# EAGLE design EndSwitch_OptoBoard (EAGLE 9.2.1)
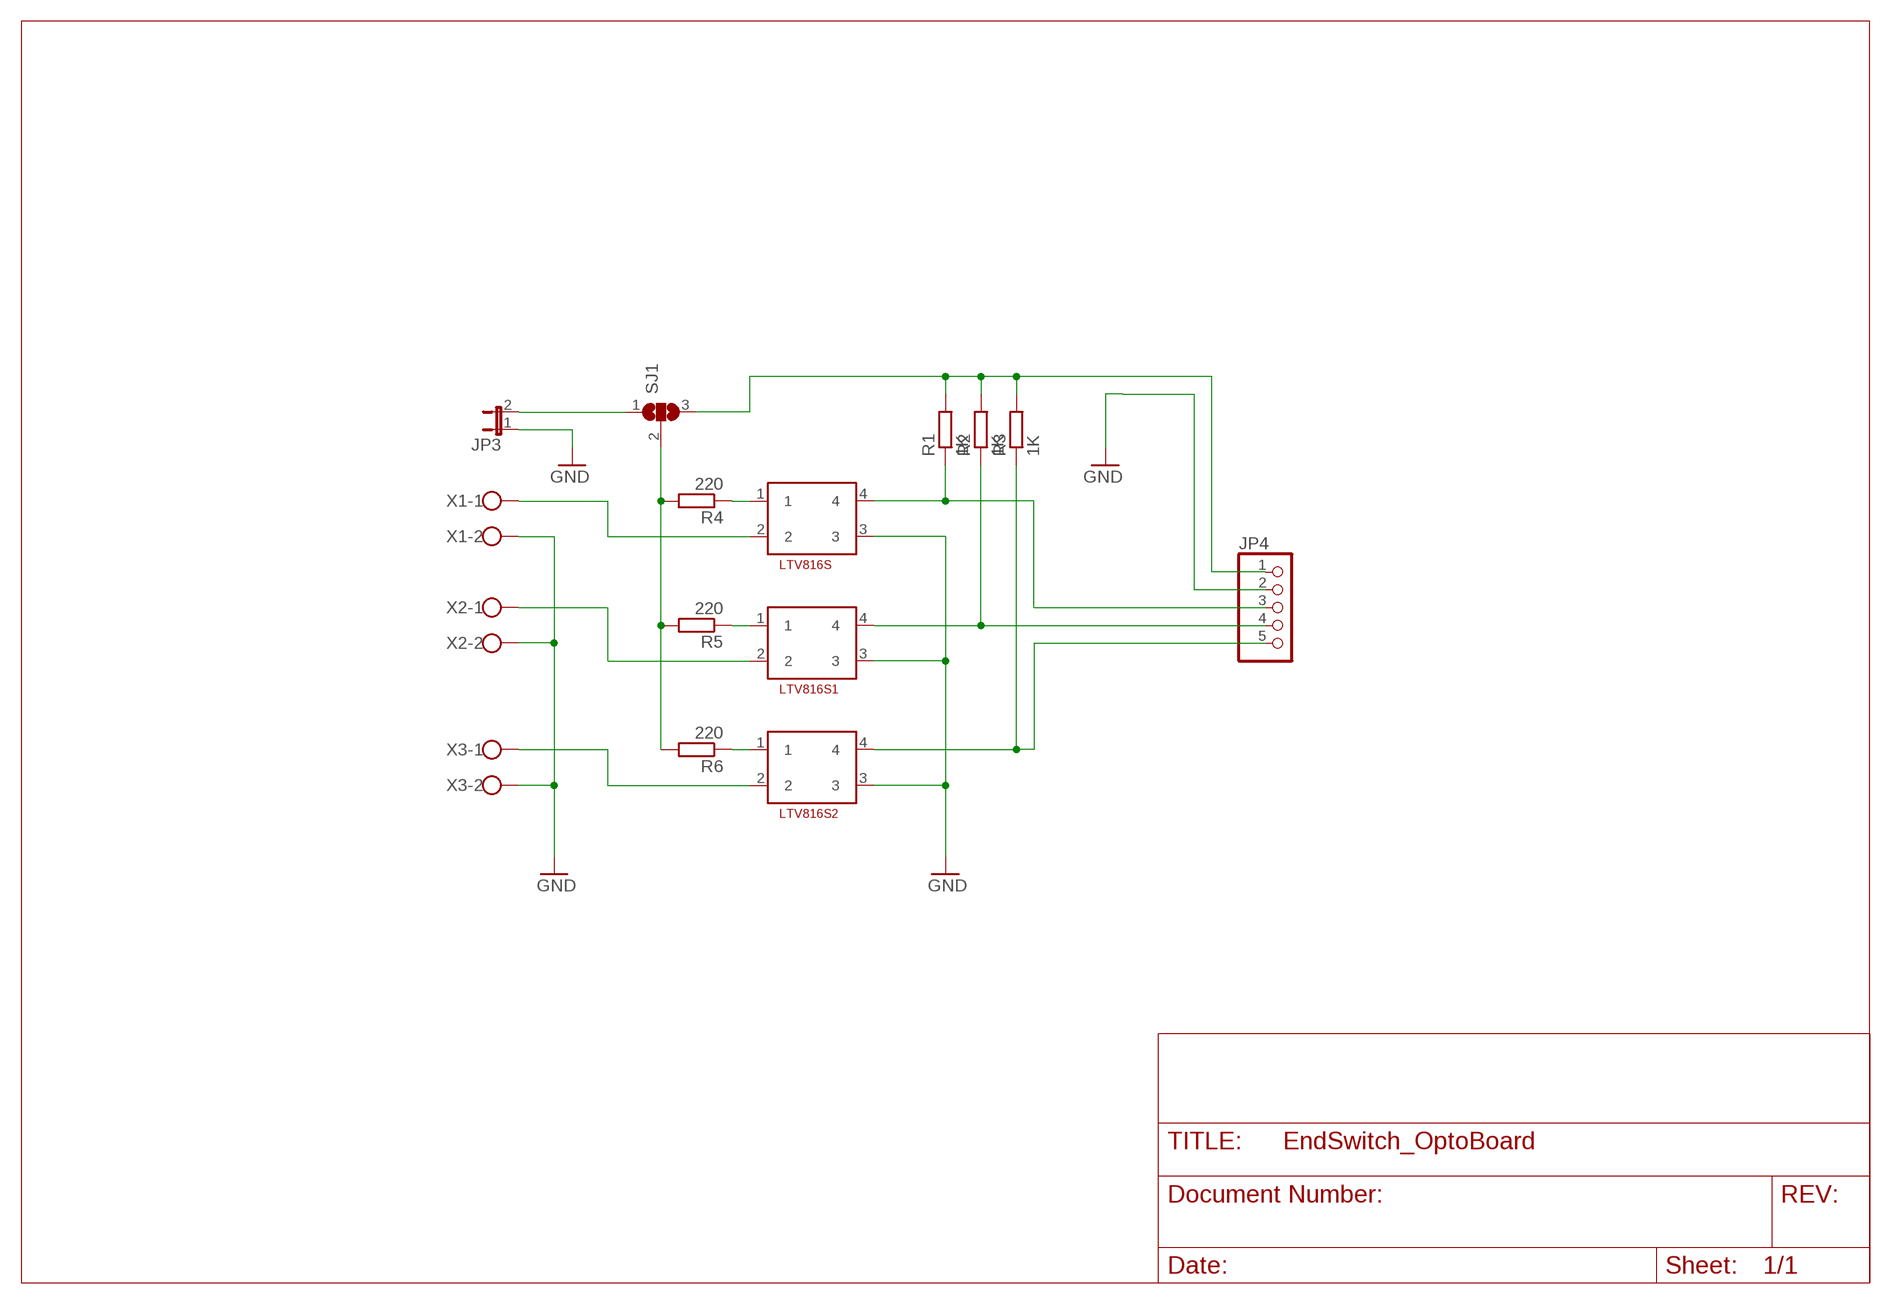
[diagram p0: schematic, sheet 1]

## Parts
JP3  JP1E  [JP1]
JP4  PINHD-1X5  [1X05]
LTV816S  LTV816S  [LTV816S]
LTV816S1  LTV816S  [LTV816S]
LTV816S2  LTV816S  [LTV816S]
R1  1K  R-EU_R0603  [R0603]
R2  1K  R-EU_R0603  [R0603]
R3  1K  R-EU_R0603  [R0603]
R4  220  R-EU_R0603  [R0603]
R5  220  R-EU_R0603  [R0603]
R6  220  R-EU_R0603  [R0603]
SJ1  SJ2W  [SJ_2]
X1  W237-102  [W237-102]
X2  W237-102  [W237-102]
X3  W237-102  [W237-102]

## Nets
GND: JP3.1 JP4.2 LTV816S1.3 LTV816S2.3 LTV816S.3 X1.2 X2.2 X3.2
N$1: LTV816S.1 R4.1
N$2: LTV816S1.1 R5.1
N$3: LTV816S2.1 R6.1
N$4: LTV816S2.2 X3.1
N$5: LTV816S1.2 X2.1
N$6: LTV816S.2 X1.1
N$7: R4.2 R5.2 R6.2 SJ1.2
N$8: JP3.2 SJ1.1
N$9: JP4.1 R1.2 R2.2 R3.2 SJ1.3
N$10: JP4.3 LTV816S.4 R1.1
N$11: JP4.4 LTV816S1.4 R2.1
N$12: JP4.5 LTV816S2.4 R3.1

## Library data of the parts
JP3 = jumper:JP1E: JUMPER
JP4 = pinhead:PINHD-1X5: PIN HEADER
LTV816S LTV816S1 LTV816S2 = LTV816s:LTV816S: Optokoppler
R1-R6 = rcl:R-EU_: RESISTOR, European symbol; SPICEPREFIX: R
SJ1 = jumper:SJ2W: SMD solder JUMPER
X1-X3 = con-wago-500:W237-102: WAGO SCREW CLAMP; MPN: 237-102; OC_FARNELL: unknown; OC_NEWARK: 70K9898

## Net classes
0 default: clearance 0.205 mm

## Board
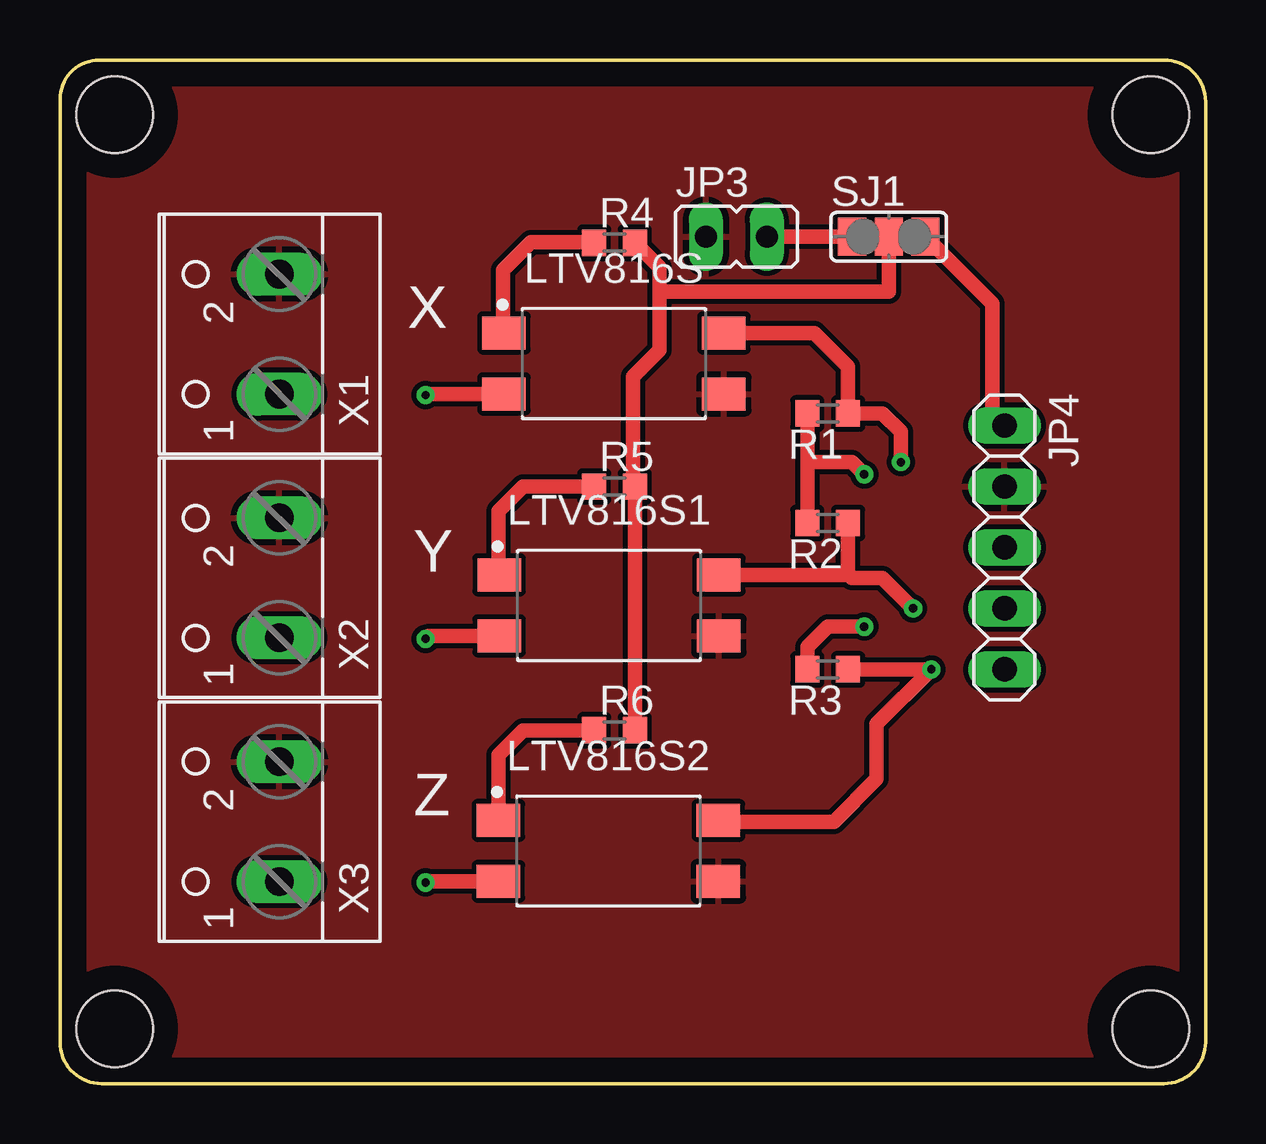
[diagram p1: board, top side]
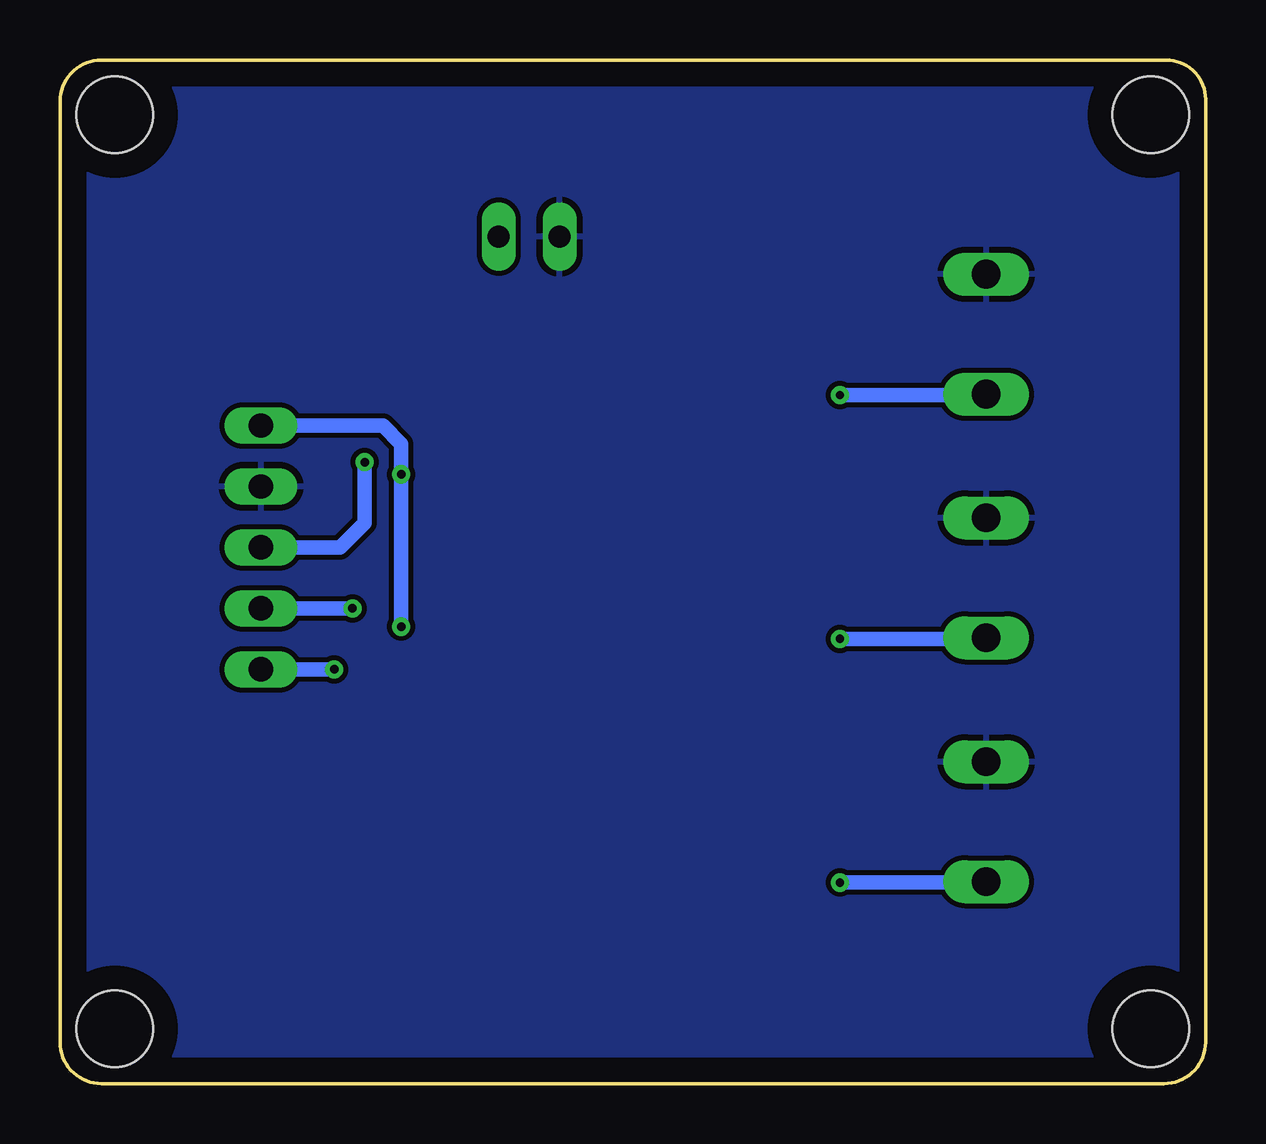
[diagram p2: board, bottom side, seen from below]

Size 47.75 x 42.67 mm. Coordinates in mm from the lower left corner, seen from the top.
Outline: 47.75,40.94 47.75,1.73 arc-90 46.02,0 1.73,0 arc-90 0,1.73 0,41.03 arc-90 1.64,42.67 46.02,42.67 arc-90 47.75,40.94
Copper layers (1*16): Top 0.035mm / dielectric 1.5mm / Bottom 0.035mm
Design rules "default": minimum track width 6mil, minimum drill 0.35mm, track to track 6mil, track to pad 6mil, pad to pad 6mil, via to via 6mil, smd to smd 6mil, copper to edge 40mil, drill to drill 6mil, minimum pad ring 10mil, minimum via ring 8mil, stop-mask expansion 4mil, vias tented up to drill 0mil, thermal gap 10mil
Holes 3.2 mm at 45.47,2.29 45.47,40.39 2.29,2.29 2.29,40.39

### Footprints (pad centres in the part's own frame; a part is rotated, then mirrored left to right if it is on the bottom)
JP1 = drill 0.914 long: 1 0,-1.27; 2 0,1.27
1X05 = drill 1.016 long: 1 -5.08,0; 2 -2.54,0; 3 0,0; 4 2.54,0; 5 5.08,0
LTV816S = smd 1.812 x 1.372: 1 -4.58,1.27; 2 -4.58,-1.27; 3 4.58,-1.27; 4 4.58,1.27
R0603 = smd 1 x 1.1: 1 -0.85,0; 2 0.85,0
SJ_2 = smd 1.168 x 1.6: 1 -1.524,0; 2 0,0; 3 1.524,0
W237-102 = drill 1.194 long: 1 -2.5,-1.27; 2 2.5,-1.27

### Placement (x,y rotation side)
JP3  28.19,35.31 270 top
JP4  39.37,22.35 270 top
LTV816S  23.09,30.02 0 top
LTV816S1  22.89,19.94 0 top
LTV816S2  22.86,9.7 0 top
R1  32,27.94 180 top
R2  32,23.37 180 top
R3  32,17.27 180 top
R4  23.11,35.05 0 top
R5  23.11,24.89 0 top
R6  23.11,14.73 0 top
SJ1  34.54,35.31 0 top
X1  7.87,31.24 90 top
X2  7.87,21.08 90 top
X3  7.87,10.92 90 top

### Tracks (layer width: path | path; a pad name or v marks a point on that pad's centre or on a via)
GND
  pour Top: 3.05,42.67 45.6,42.67 arc-90 47.75,40.52 47.75,2.15 arc-90 45.6,0 2.15,0 arc-90 0,2.15 0,40.94 arc-90 1.73,42.67
  pour Bottom: 45.6,0 2.15,0 arc-90 0,2.15 0,40.94 arc-90 1.73,42.67 45.6,42.67 arc-90 47.75,40.52 47.75,2.15 arc-90
N$1
  Top 0.61: LTV816S.1 arc-90 18.47,31.34 18.47,33.91 19.63,35.08 22.24,35.08 R4.1
N$2
  Top 0.61: R5.1 19.3,24.89 18.29,23.88 18.29,21.23 LTV816S1.1
N$3
  Top 0.61: R6.1 19.3,14.73 18.28,13.71 LTV816S2.1
N$4  (via drill 0.35)
  Top 0.61: LTV816S2.2 15.29,8.43 v15.24,8.38
  Bottom 0.61: v15.24,8.38 9.24,8.38 arc-45 X3.1
N$5  (via drill 0.35)
  Top 0.61: LTV816S1.2 15.37,18.67 v15.24,18.54
  Bottom 0.61: v15.24,18.54 9.24,18.54 arc-45 X2.1
N$6  (via drill 0.35)
  Top 0.61: v15.24,28.7 15.28,28.74 LTV816S.2
  Bottom 0.61: v15.24,28.7 9.18,28.7 X1.1
N$7
  Top 0.61: SJ1.2 34.54,33.02 24.98,33.02 | R4.2 24.98,34.04 24.98,33.53 24.98,33.02 | R6.2 R5.2 23.88,24.98 23.88,29.46 24.98,30.57 24.98,33.02
N$8
  Top 0.61: SJ1.1 JP3.2
N$9  (via drill 0.35)
  Top 0.61: SJ1.3 38.86,32.51 38.86,27.94 JP4.1 | R1.2 31.15,25.91 | 31.15,25.91 R2.2 | R3.2 31.15,18.2 32,19.05 v33.53,19.05 | R1.2 | 31.15,25.91 33.02,25.91 v33.53,25.4
  Bottom 0.61: v33.53,19.05 v33.53,25.4 33.53,26.67 34.29,27.43 JP4.1
N$10  (via drill 0.35)
  Top 0.61: v35.05,25.91 35.05,27.18 34.29,27.94 R1.1 32.85,29.88 31.45,31.29 LTV816S.4
  Bottom 0.61: v35.05,25.91 35.05,23.37 36.07,22.35 JP4.3
N$11  (via drill 0.35)
  Top 0.61: R2.1 32.85,21.25 | 32.85,21.25 33.02,21.08 34.29,21.08 v35.56,19.81 | LTV816S1.4 32.81,21.21 32.85,21.25
  Bottom 0.61: v35.56,19.81 JP4.4
N$12  (via drill 0.35)
  Top 0.61: R3.1 v36.32,17.27 34.04,14.99 34.04,12.7 32.26,10.92 27.49,10.92 LTV816S2.4
  Bottom 0.61: JP4.5 v36.32,17.27

### Text on the board
tPlace: X | Y | Z
tDocu: 1-2 getrennte Versorgung / 2-3 standard, einfache Versorgung | 1 2 3 | GND | +5V | Arduino | +5V | GND | X-Axis | Y-Axis | Z-Axis | End-Schalter | GRBL_Optokopplerplatine
bDocu: v.1/09/2018 / https://github.com/Syver81/GRBL_OptoBoard